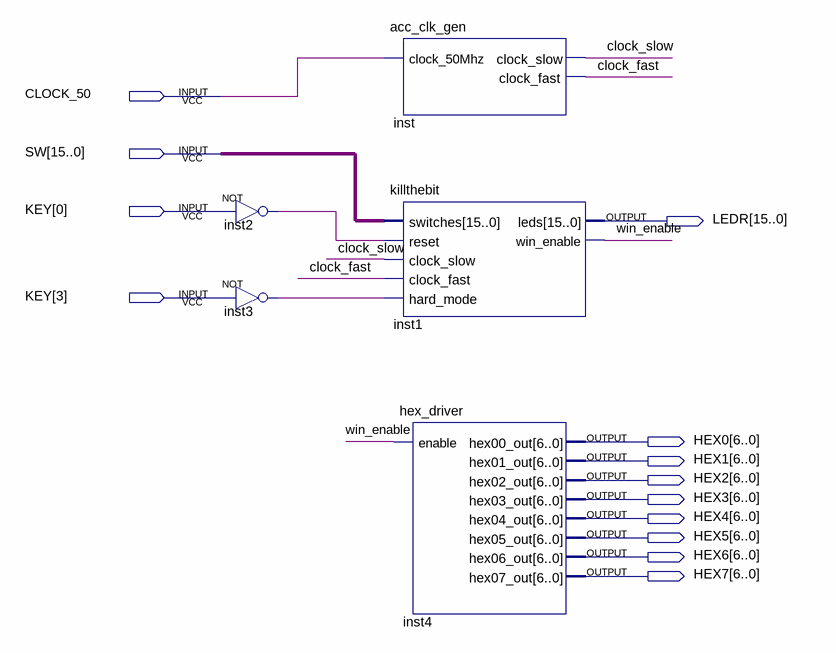
[diagram p0: schematic sheet]
// Quartus schematic killthebittop.bdf as structural Verilog: 5 symbols, 13 pins
module killthebittop (
  input  CLOCK_50,
  input  [15:0] SW,
  input  [3:0] KEY,
  output [15:0] LEDR,
  output [6:0] HEX0,
  output [6:0] HEX1,
  output [6:0] HEX2,
  output [6:0] HEX3,
  output [6:0] HEX4,
  output [6:0] HEX5,
  output [6:0] HEX6,
  output [6:0] HEX7
);

  wire clock_fast, clock_slow, inst2_out, inst3_out, win_enable;

  not inst2 (inst2_out, KEY[0]);
  not inst3 (inst3_out, KEY[3]);
  acc_clk_gen inst (.clock_50Mhz(CLOCK_50), .clock_slow(clock_slow), .clock_fast(clock_fast));
  killthebit inst1 (
    .switches(SW), .reset(inst2_out), .clock_slow(clock_slow), .clock_fast(clock_fast),
    .hard_mode(inst3_out), .leds(LEDR), .win_enable(win_enable));
  hex_driver inst4 (
    .enable(win_enable), .hex00_out(HEX0), .hex01_out(HEX1), .hex02_out(HEX2), .hex03_out(HEX3),
    .hex04_out(HEX4), .hex05_out(HEX5), .hex06_out(HEX6), .hex07_out(HEX7));
endmodule
